# EAGLE design wheel (EAGLE 6.3)
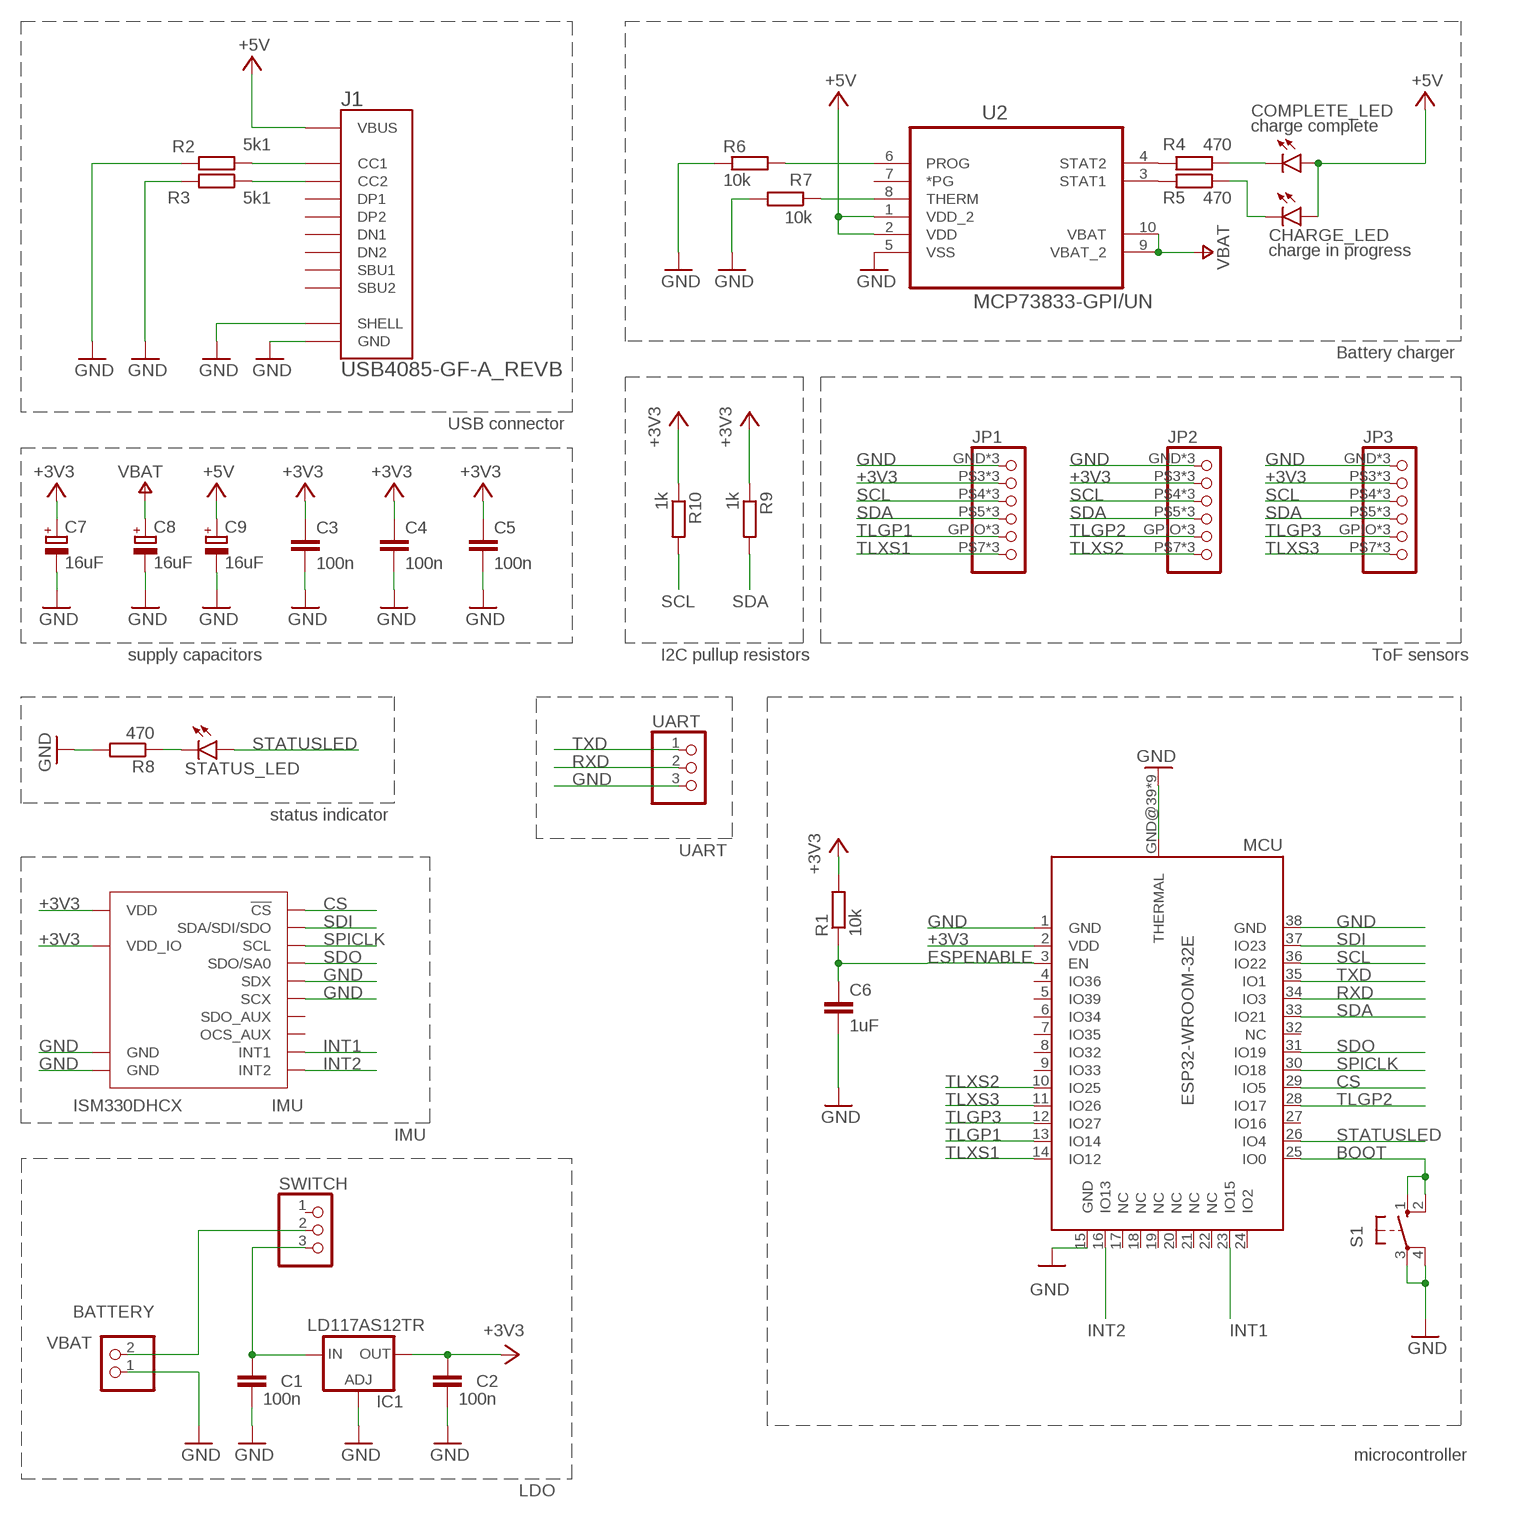
[diagram p0: schematic, sheet 1]

## Parts
BATTERY  PINHD-1X2  [1X02]
C1  100n  C-EUC1206  [C1206]
C2  100n  C-EUC1206  [C1206]
C3  100n  C-EUC1206  [C1206]
C4  100n  C-EUC1206  [C1206]
C5  100n  C-EUC1206  [C1206]
C6  1uF  C-EUC1206  [C1206]
C7  16uF  CPOL-EUE2.5-7  [E2,5-7]
C8  16uF  CPOL-EUE2.5-7  [E2,5-7]
C9  16uF  CPOL-EUE2.5-7  [E2,5-7]
CHARGE_LED  charge in progress  LEDCHIPLED_1206  [CHIPLED_1206]
COMPLETE_LED  charge complete  LEDCHIPLED_1206  [CHIPLED_1206]
IC1  LD117AS12TR  [SOT223]
IMU  ISM330DHCX  [LGA-14L]
J1  USB4085-GF-A_REVB  [GCT_USB4085-GF-A_REVB]
JP1  PINHD-1X6  [1X06]
JP2  PINHD-1X6  [1X06]
JP3  PINHD-1X6  [1X06]
MCU  ESP32-WROOM-32E  [ESP32-WROOM-32E]
R1  10k  R-EU_R1206  [R1206]
R2  5k1  R-EU_R1206  [R1206]
R3  5k1  R-EU_R1206  [R1206]
R4  470  R-EU_R1206  [R1206]
R5  470  R-EU_R1206  [R1206]
R6  10k  R-EU_R1206  [R1206]
R7  10k  R-EU_R1206  [R1206]
R8  470  R-EU_R1206  [R1206]
R9  1k  R-EU_R1206  [R1206]
R10  1k  R-EU_R1206  [R1206]
S1  10-XX  [B3F-10XX]
STATUS_LED  status  LEDCHIPLED_1206  [CHIPLED_1206]
SWITCH  PINHD-1X3  [1X03]
U2  MCP73833-GPI/UN  [SOP50P490X110-10N]
UART  PINHD-1X3  [1X03]

## Nets
+3V3: C2.1 C3.1 C4.1 C5.1 C7.+ IC1.4(OUT) IMU.P5(VDD_IO) IMU.P8(VDD) JP1.P$3 JP1.P$8 JP1.VCC JP2.P$3 JP2.P$8 JP2.VCC JP3.P$3 JP3.P$8 JP3.VCC MCU.2(VDD) R1.2 R9.1 R10.1
+5V: C9.+ CHARGE_LED.A COMPLETE_LED.A J1.A4(VBUS) J1.A9(VBUS) J1.B4(VBUS) J1.B9(VBUS) U2.1(VDD_2) U2.2(VDD)
BOOT: MCU.25(IO0) S1.1(S) S1.2(S1)
CS: IMU.P12(!CS!) MCU.29(IO5)
ESPENABLE: C6.1 MCU.3(EN) R1.1
GND: BATTERY.1 C1.2 C2.2 C3.2 C4.2 C5.2 C6.2 C7.- C8.- C9.- IC1.1(ADJ) IMU.P2(SDX) IMU.P3(SCX) IMU.P6(GND) IMU.P7(GND) J1.A1(GND) J1.A12(GND) J1.B1(GND) J1.B12(GND) J1.S1(SHELL) J1.S2(SHELL) J1.S3(SHELL) J1.S4(SHELL) JP1.GND JP1.P$1 JP1.P$2 JP2.GND JP2.P$1 JP2.P$2 JP3.GND JP3.P$1 JP3.P$2 MCU.1(GND) MCU.15(GND) MCU.38(GND) MCU.GND@39(THERMAL) MCU.GND@40(THERMAL) MCU.GND@41(THERMAL) MCU.GND@42(THERMAL) MCU.GND@43(THERMAL) MCU.GND@44(THERMAL) MCU.GND@45(THERMAL) MCU.GND@46(THERMAL) MCU.GND@47(THERMAL) R2.2 R3.2 R6.2 R7.2 R8.2 S1.3(P) S1.4(P1) U2.5(VSS) UART.3
INT1: IMU.P4(INT1) MCU.23(IO15)
INT2: IMU.P9(INT2) MCU.16(IO13)
N$1: R4.2 U2.4(STAT2)
N$2: C1.1 IC1.3(IN) SWITCH.3
N$3: J1.A5(CC1) R2.1
N$4: J1.B5(CC2) R3.1
N$8: R5.2 U2.3(STAT1)
N$9: R6.1 U2.6(PROG)
N$18: COMPLETE_LED.C R4.1
N$19: CHARGE_LED.C R5.1
N$20: R7.1 U2.8(THERM)
N$21: R8.1 STATUS_LED.C
RXD: MCU.34(IO3) UART.2
SCL: JP1.P$4 JP1.P$9 JP1.SCL JP2.P$4 JP2.P$9 JP2.SCL JP3.P$4 JP3.P$9 JP3.SCL MCU.36(IO22) R10.2
SDA: JP1.P$5 JP1.P$10 JP1.SDA JP2.P$5 JP2.P$10 JP2.SDA JP3.P$5 JP3.P$10 JP3.SDA MCU.33(IO21) R9.2
SDI: IMU.P14(SDA/SDI/SDO) MCU.37(IO23)
SDO: IMU.P1(SDO/SA0) MCU.31(IO19)
SPICLK: IMU.P13(SCL) MCU.30(IO18)
STATUSLED: MCU.26(IO4) STATUS_LED.A
TLGP1: JP1.GPIO JP1.P$6 JP1.P$11 MCU.13(IO14)
TLGP2: JP2.GPIO JP2.P$6 JP2.P$11 MCU.28(IO17)
TLGP3: JP3.GPIO JP3.P$6 JP3.P$11 MCU.12(IO27)
TLXS1: JP1.P$7 JP1.P$12 JP1.XSHUT MCU.14(IO12)
TLXS2: JP2.P$7 JP2.P$12 JP2.XSHUT MCU.10(IO25)
TLXS3: JP3.P$7 JP3.P$12 JP3.XSHUT MCU.11(IO26)
TXD: MCU.35(IO1) UART.1
VBAT: BATTERY.2 C8.+ SWITCH.2 U2.9(VBAT_2) U2.10(VBAT)
Unconnected: IMU.P10(OCS_AUX) IMU.P11(SDO_AUX) J1.A6(DP1) J1.A7(DN1) J1.A8(SBU1) J1.B6(DP2) J1.B7(DN2) J1.B8(SBU2) MCU.4(IO36) MCU.5(IO39) MCU.6(IO34) MCU.7(IO35) MCU.8(IO32) MCU.9(IO33) MCU.17(NC) MCU.18(NC) MCU.19(NC) MCU.20(NC) MCU.21(NC) MCU.22(NC) MCU.24(IO2) MCU.27(IO16) MCU.32(NC) SWITCH.1 U2.7(*PG)

## Notes on the sheet
- Battery charger
- USB connector
- supply capacitors | I2C pullup resistors | ToF sensors
- status indicator
- UART
- IMU
- microcontroller
- LDO

## Library data of the parts
BATTERY = pinhead:PINHD-1X2: PIN HEADER
C1-C6 = rcl:C-EU: CAPACITOR, European symbol; SPICEPREFIX: C
C7-C9 = rcl:CPOL-EU: POLARIZED CAPACITOR, European symbol; SPICEPREFIX: C
CHARGE_LED COMPLETE_LED STATUS_LED = led:LED: LED OSRAM: - CHIPLED LG R971, LG N971, LY N971, LG Q971, LY Q971, LO R971, LY R971 LH N974, LH R974 LS Q976, LO Q976, LY Q976 LO Q996 - Hyper CHIPLED LW Q18S LB Q993, LB Q99A, LB R99A - SideLED LS A670, LO A670, LY A670, LG A670, LP A670 LB A673, LV A673, LT A673, LW A673 LH A674 LY A675 LS A676, LA A676, LO A676, LY A676, LW A676 LS A679, LY A679, LG A679 - Hyper Micro SIDELED® LS Y876, LA Y876, LO Y876, LY Y876 LT Y87S - SmartLED LW L88C, LW L88S LB L89C, LB L89S, LG L890 LS L89K, LO L89K, LY L89K LS L896, LA L896, LO L896, LY L896 - TOPLED LS T670, LO T670, LY T670, LG T670, LP T670 LSG T670, LSP T670, LSY T670, LOP T670, LYG T670 LG T671, LOG T671, LSG T671 LB T673, LV T673, LT T673, LW T673 LH T674 LS T676, LA T676, LO T676, LY T676, LB T676, LH T676, LSB T676, LW T676 LB T67C, LV T67C, LT T67C, LS T67K, LO T67K, LY T67K, LW E67C LS E67B, LA E67B, LO E67B, LY E67B, LB E67C, LV E67C, LT E67C LW T67C LS T679, LY T679, LG T679 LS T770, LO T770, LY T770, LG T770, LP T770 LB T773, LV T773, LT T773, LW T773 LH T774 LS E675, LA E675, LY E675, LS T675 LS T776, LA T776, LO T776, LY T776, LB T776 LHGB T686 LT T68C, LB T68C - Hyper Mini TOPLED® LB M676 - Mini TOPLED Santana® LG M470 LS M47K, LO M47K, LY M47K Source: http://www.osram.convergy.de LUXEON: - LUMILED® LXK2-PW12-R00, LXK2-PW12-S00, LXK2-PW14-U00, LXK2-PW14-V00 LXK2-PM12-R00, LXK2-PM12-S00, LXK2-PM14-U00 LXK2-PE12-Q00, LXK2-PE12-R00, LXK2-PE12-S00, LXK2-PE14-T00, LXK2-PE14-U00 LXK2-PB12-K00, LXK2-PB12-L00, LXK2-PB12-M00, LXK2-PB14-N00, LXK2-PB14-P00, LXK2-PB14-Q00 LXK2-PR12-L00, LXK2-PR12-M00, LXK2-PR14-Q00, LXK2-PR14-R00 LXK2-PD12-Q00, LXK2-PD12-R00, LXK2-PD12-S00 LXK2-PH12-R00, LXK2-PH12-S00 LXK2-PL12-P00, LXK2-PL12-Q00, LXK2-PL12-R00 Source: www.luxeon.com KINGBRIGHT: KA-3528ASYC Source: www.kingbright.com
IC1 = v-reg:LD117A?*: Low drop fixed and adjustable positive voltage regulators 1 A Source: http://www.st.com/stonline/products/literature/ds/7194/ld1117axx.pdf
IMU = SparkFun-Sensors:ISM330DHCX: ISM330DHCX 6DoF The ISM330DHCX is a system-in-package featuring a high-performance 3D digital accelerometer and 3D digital gyroscope tailored for Industry 4.0 applications.; PROD_ID: IC-16693
J1 = USB4085-GF-A_REVB:USB4085-GF-A_REVB: Check availability <https://pricing.snapeda.com/parts/USB4085-GF-A/Global%20Connector%20Technology/view-part?ref=eda>; AVAILABILITY: In Stock; CHECK_PRICES: https://www.snapeda.com/parts/USB4085-GF-A/Global+Connector+Technology/view-part/?ref=eda; DESCRIPTION: USB-C (USB TYPE-C) USB 2.0 Receptacle Connector 24 (16+8 Dummy) Position Through Hole, Right Angle, low cost, 3.46mm profile, 16 pin, horizontal, Top mount; MF: Global Connector Technology; MP: USB4085-GF-A; PACKAGE: None; PRICE: None; PURCHASE-URL: https://www.snapeda.com/api/url_track_click_mouser/?unipart_id=2780390&manufacturer=Global Connector Technology&part_name=USB4085-GF-A&search_term=usb connector lumberg; SNAPEDA_LINK: https://www.snapeda.com/parts/USB4085-GF-A/Global+Connector+Technology/view-part/?ref=snap
JP1-JP3 = pinhead2:PINHD-1X6: PIN HEADER
MCU = ESP32-WROOM-32E:ESP32-WROOM-32E: Check availability <https://pricing.snapeda.com/parts/ESP32-WROOM-32E/Espressif%20Systems/view-part?ref=eda>; AVAILABILITY: In Stock; CHECK_PRICES: https://www.snapeda.com/parts/ESP32-WROOM-32E/Espressif+Systems/view-part/?ref=eda; DESCRIPTION: RX TXRX MOD WIFI TRACE ANT SMD; MF: Espressif Systems; MP: ESP32-WROOM-32E; PACKAGE: SMD-44 Espressif Systems; PRICE: None; SNAPEDA_LINK: https://www.snapeda.com/parts/ESP32-WROOM-32E/Espressif+Systems/view-part/?ref=snap
R1-R10 = rcl:R-EU_: RESISTOR, European symbol; SPICEPREFIX: R
S1 = switch-omron:10-XX: OMRON SWITCH; MPN: B3F-1000; OC_FARNELL: 176432; OC_NEWARK: 36M3542
SWITCH UART = pinhead:PINHD-1X3: PIN HEADER
U2 = MCP73833-GPI_UN:MCP73833-GPI/UN: LI-ION/LI-POLY CONTROLLERS Check availability <https://pricing.snapeda.com/parts/MCP73833-GPI/UN/Microchip/view-part?ref=eda>; AVAILABILITY: In Stock; CHECK_PRICES: https://www.snapeda.com/parts/MCP73833-GPI/UN/Microchip/view-part/?ref=eda; DESCRIPTION: Microchip MCP73833-GPI/UN, Charge Management Controller, 1000mA, 10-Pin MSOP | Microchip Technology Inc. MCP73833-GPI/UN; MF: Microchip; MP: MCP73833-GPI/UN; PACKAGE: MSOP-10 Microchip; PRICE: None; SNAPEDA_LINK: https://www.snapeda.com/parts/MCP73833-GPI/UN/Microchip/view-part/?ref=snap

## Board
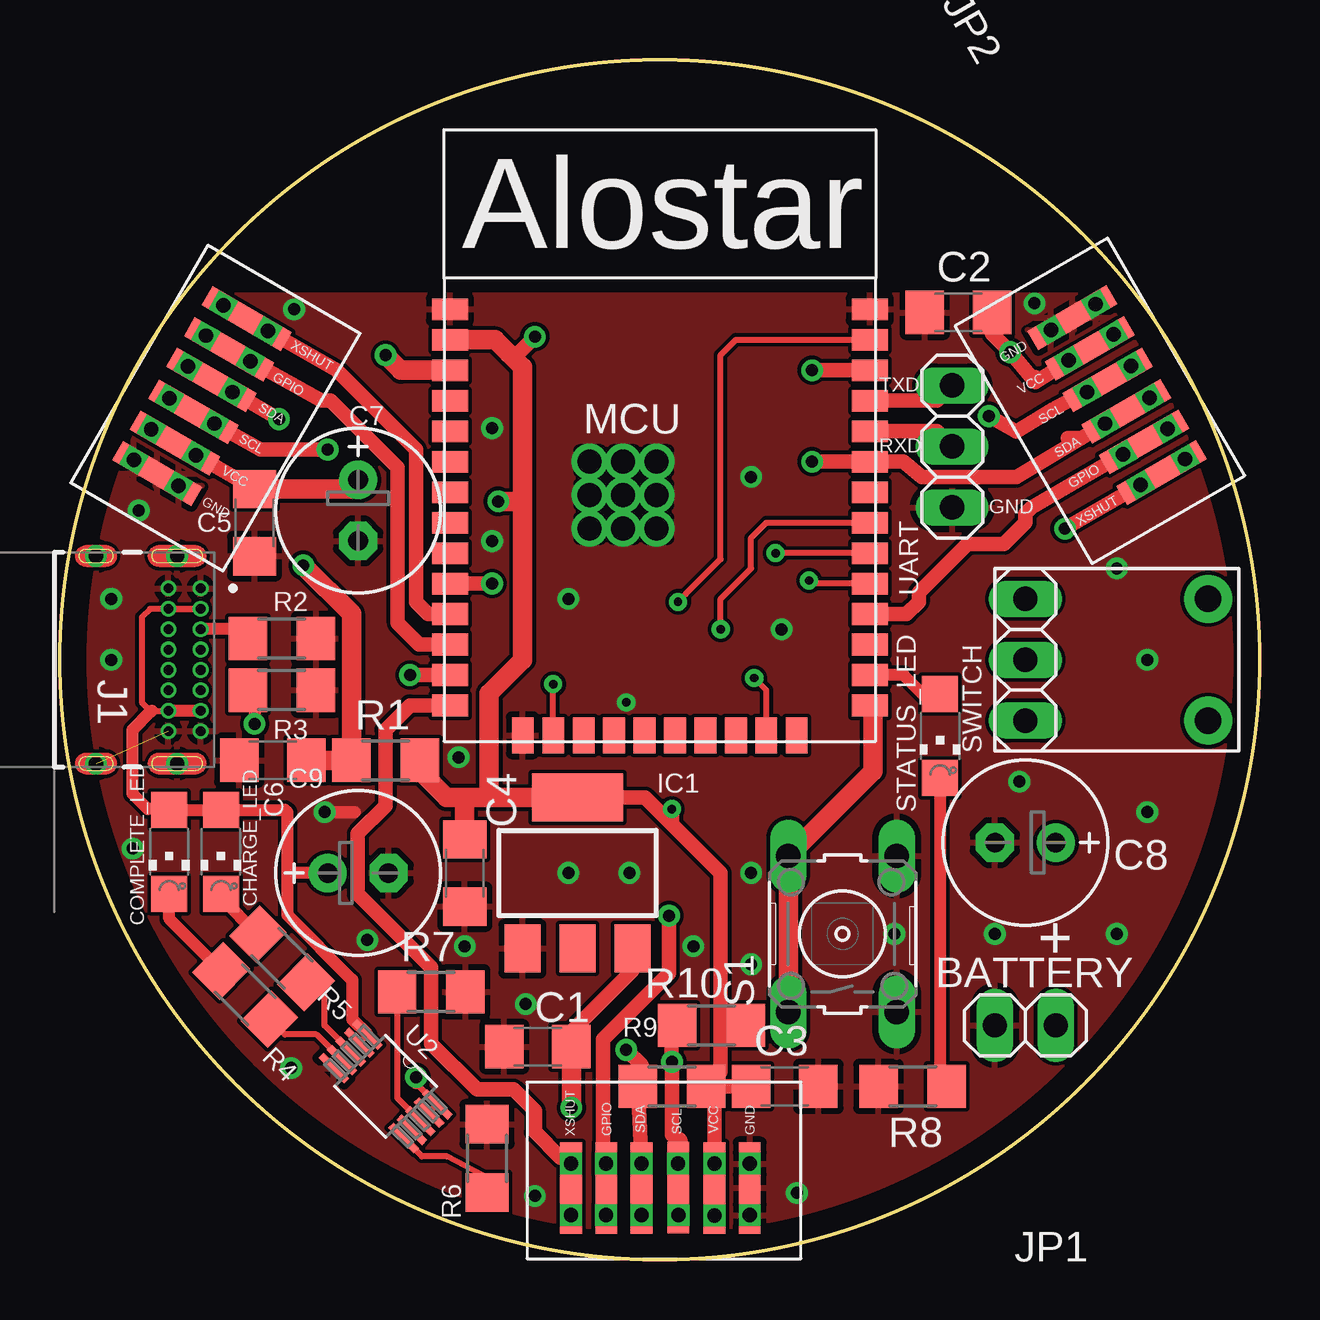
[diagram p1: board, top side]
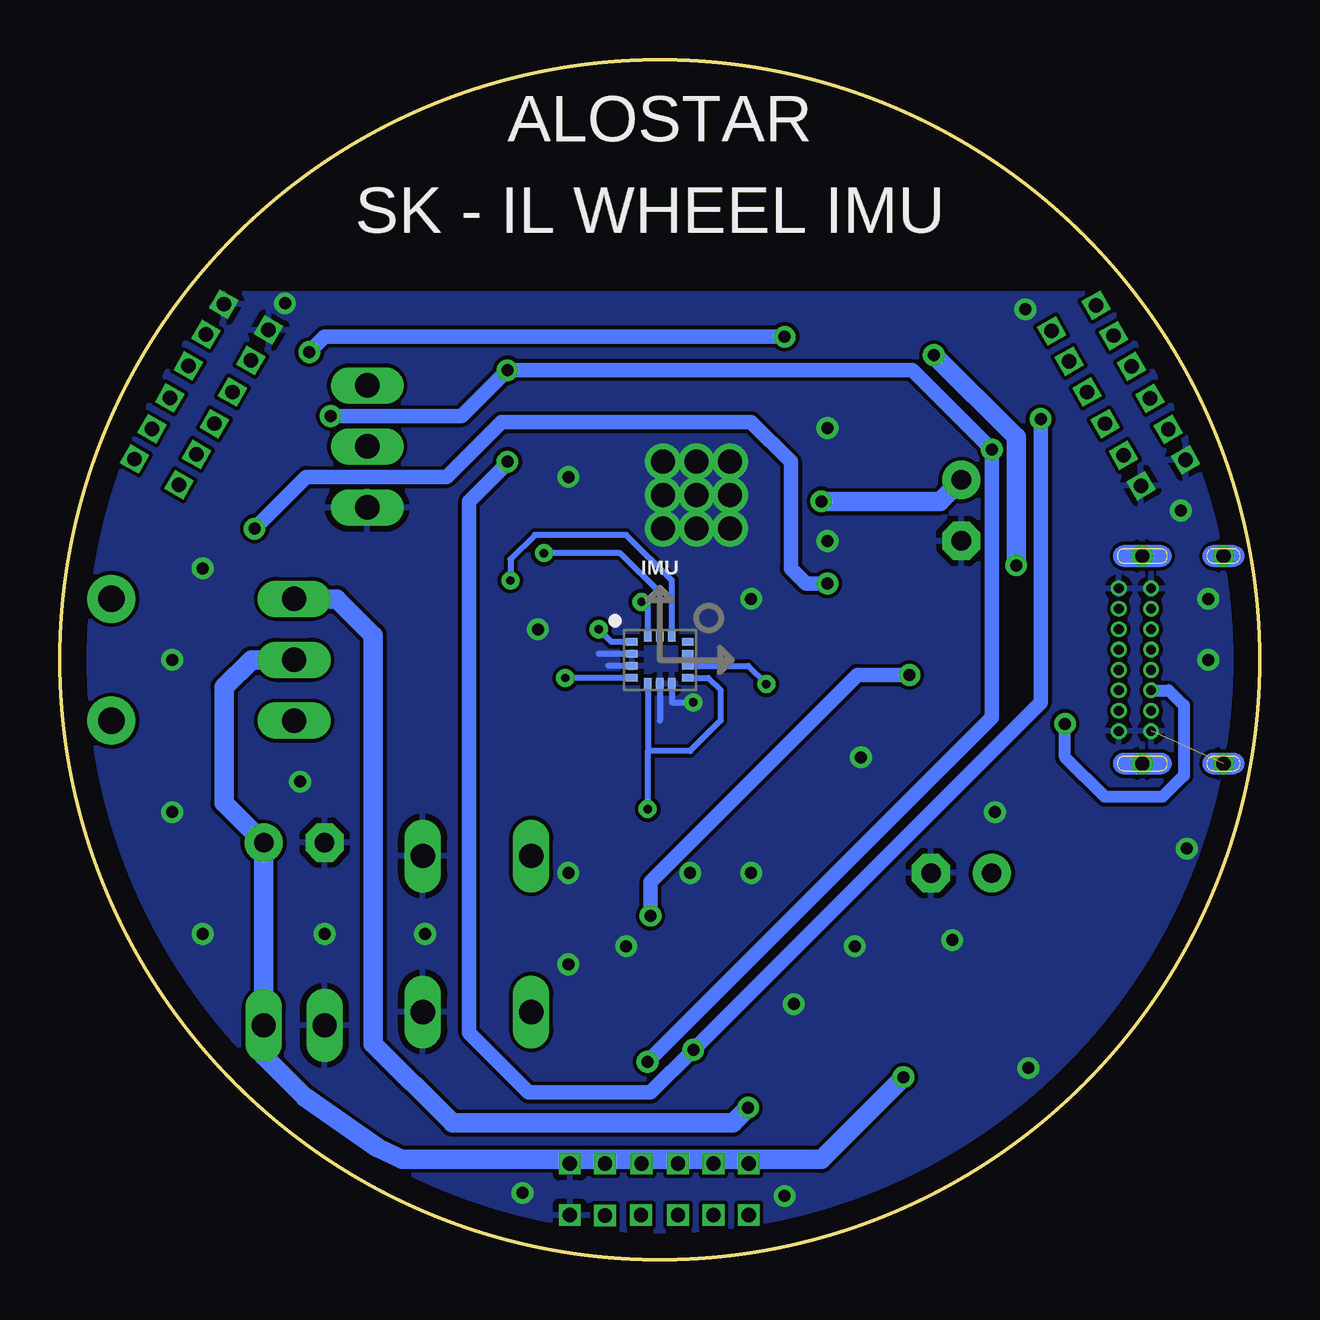
[diagram p2: board, bottom side, seen from below]

Size 50 x 50 mm. Coordinates in mm from the lower left corner, seen from the top.
Outline: circle at 25,25 radius 25
Copper layers (1*16): Top 0.035mm / dielectric 1.5mm / Bottom 0.035mm
Design rules "default *": minimum track width 6mil, minimum drill 0.35mm, track to track 6mil, track to pad 6mil, pad to pad 6mil, via to via 6mil, smd to smd 6mil, copper to edge 40mil, drill to drill 6mil, minimum pad ring 5mil, minimum via ring 8mil, stop-mask expansion 4mil, vias tented up to drill 0mil, thermal gap 10mil

### Footprints (pad centres in the part's own frame; a part is rotated, then mirrored left to right if it is on the bottom)
1X02 = drill 1.016 long: 1 -1.27,0; 2 1.27,0
C1206 = smd 1.6 x 1.8: 1 -1.4,0; 2 1.4,0
E2,5-7 = drill 0.813 pad 1.6: + -1.27,0 | drill 0.813 pad 1.6 octagon: - 1.27,0
CHIPLED_1206 = smd 1.5 x 1.5: A 0,-1.75; C 0,1.75
SOT223 = smd 1.5 x 2: 1 -2.3,-3.15; 2 0,-3.15; 3 2.3,-3.15 | smd 3.8 x 2: 4 0,3.15
LGA-14L = smd 0.48 x 0.3: P1 -1.163,0.75; P2 -1.163,0.25; P3 -1.163,-0.25; P4 -1.163,-0.75; P8 1.163,-0.75; P9 1.163,-0.25; P10 1.163,0.25; P11 1.163,0.75 | smd 0.3 x 0.48: P5 -0.5,-1; P6 0,-1; P7 0.5,-1; P12 0.5,1; P13 0,1; P14 -0.5,1
GCT_USB4085-GF-A_REVB = drill 0.4 pad 0.65: A1 -2.975,4.36; A4 -2.125,4.36; A5 -1.275,4.36; A6 -0.425,4.36; A7 0.425,4.36; A8 1.275,4.36; A9 2.125,4.36; A12 2.975,4.36; B1 2.975,3.01; B4 2.125,3.01; B5 1.275,3.01; B6 0.425,3.01; B7 -0.425,3.01; B8 -1.275,3.01; B9 -2.125,3.01; B12 -2.975,3.01 | drill 0.6 pad 0.9: S1 -4.325,0; S2 4.325,0; S3 -4.325,3.38; S4 4.325,3.38
1X06 = smd 0.914 x 3.81: GND -3.75,0.02; GPIO 2.23,0.02; SCL -0.77,0; SDA 0.76,0.02; VCC -2.28,0.02; XSHUT 3.7,0.02 | drill 0.6 pad 0.813 square: P$1 -3.75,1.15; P$2 -3.75,-1; P$3 -2.28,-1; P$4 -0.76,-1; P$5 0.76,-1; P$6 2.24,-1; P$7 3.7,-1; P$8 -2.28,1.16; P$9 -0.78,1.14; P$10 0.76,1.14; P$11 2.24,1.14; P$12 3.7,1.14
ESP32-WROOM-32E = smd 1.5 x 0.9: 1 -8.75,8.255; 2 -8.75,6.985; 3 -8.75,5.715; 4 -8.75,4.445; 5 -8.75,3.175; 6 -8.75,1.905; 7 -8.75,0.635; 8 -8.75,-0.635; 9 -8.75,-1.905; 10 -8.75,-3.175; 11 -8.75,-4.445; 12 -8.75,-5.715; 13 -8.75,-6.985; 14 -8.75,-8.255; 25 8.75,-8.255; 26 8.75,-6.985; 27 8.75,-5.715; 28 8.75,-4.445; 29 8.75,-3.175; 30 8.75,-1.905; 31 8.75,-0.635; 32 8.75,0.635; 33 8.75,1.905; 34 8.75,3.175; 35 8.75,4.445; 36 8.75,5.715; 37 8.75,6.985; 38 8.75,8.255 | smd 0.9 x 1.5: 15 -5.715,-9.505; 16 -4.445,-9.505; 17 -3.175,-9.505; 18 -1.905,-9.505; 19 -0.635,-9.505; 20 0.635,-9.505; 21 1.905,-9.505; 22 3.175,-9.505; 23 4.445,-9.505; 24 5.715,-9.505 | smd 0.9 x 0.9: GND@39 -2.9,1.935; GND@40 -1.5,1.935; GND@41 -0.1,1.935; GND@42 -2.9,0.535; GND@43 -1.5,0.535; GND@44 -0.1,0.535; GND@45 -2.9,-0.865; GND@46 -1.5,-0.865; GND@47 -0.1,-0.865
R1206 = smd 1.6 x 1.803: 1 -1.422,0; 2 1.422,0
B3F-10XX = drill 1.016 long: 1 -3.251,2.261; 2 3.251,2.261; 3 -3.251,-2.261; 4 3.251,-2.261
1X03 = drill 1.016 long: 1 -2.54,0; 2 0,0; 3 2.54,0
SOP50P490X110-10N = smd 1.499 x 0.305: 1 -2.057,0.991; 2 -2.057,0.508; 3 -2.057,0; 4 -2.057,-0.508; 5 -2.057,-0.991; 6 2.057,-0.991; 7 2.057,-0.508; 8 2.057,0; 9 2.057,0.508; 10 2.057,0.991

### Placement (x,y rotation side)
BATTERY  40.24,9.76 0 top
C1  19.92,8.87 180 top
C2  37.45,39.48 180 top
C3  30.21,7.22 0 top
C4  16.87,16.11 270 top
C5  8.11,30.71 270 top
C6  8.87,20.81 180 top
C7  12.43,31.22 270 top
C8  40.24,17.38 180 top
C9  12.43,16.11 0 top
CHARGE_LED  6.71,17 180 top
COMPLETE_LED  4.55,17 180 top
IC1  21.57,16.11 0 top
IMU  25,25 0 bottom
J1  1.5,25 270 top
JP1  25,3 180 top
JP2  44.05,36 300 top
JP3  5.95,36 60 top
MCU  25,31.35 0 top
R1  13.57,20.81 0 top
R2  9.25,25.89 0 top
R3  9.25,23.73 0 top
R4  7.73,11.03 315 top
R5  9.25,12.55 315 top
R6  17.8,4.22 90 top
R7  15.47,11.16 0 top
R8  35.54,7.22 180 top
R9  25.51,7.22 180 top
R10  27.16,9.76 180 top
S1  32.62,13.57 90 top
STATUS_LED  36.68,21.82 180 top
SWITCH  40.24,25 90 top
U2  13.57,7.22 315 top
UART  37.19,33.89 270 top

### Tracks (layer width: path | path; a pad name or v marks a point on that pad's centre or on a via)
+3V3  (via drill 0.35, 0.5)
  Top 0.61: IC1.4 24.39,19.26 25.51,18.14 | 25.51,18.14 27.54,16.11 27.54,9.76 | v25.51,18.78 25.51,18.14 | v19.79,38.46 19.09,37.76 18.71,37.76 | R10.1 27.54,9.76 | C2.1 38.85,38.59 v39.61,37.83 40.65,36.58 | R9.1 27.54,7.83 27.54,9.76 | R9.1 27.28,6.87 JP1.P$3 JP1.VCC JP1.P$8 | C3.1 R9.1 | 40.65,36.58 JP2.VCC | 40.65,36.78 40.65,36.58 | JP3.P$8 JP3.VCC | JP3.VCC JP3.P$3 | JP3.P$3 5.57,33.51 JP3.VCC | JP3.P$3 C5.1 | JP2.VCC JP2.P$8 | JP2.VCC JP2.P$3
  Top 0.813: 19.29,31.35 19.29,37.19 18.71,37.76 18.14,38.34 MCU.2 | 19.29,31.35 19.29,25 17.89,23.6 17.89,19.26 | 17.89,19.26 IC1.4 | v18.27,31.6 19.03,31.6 19.29,31.35 | C5.1 12.3,32.12 12.43,32.24 C7.+ | 15.37,20.43 R1.2 14.99,20.38 16.11,19.26 16.87,19.26 | C4.1 16.87,19.26 | 17.89,19.26 16.87,19.26
  Bottom 0.254: 25.5,21.19 23.73,21.19 22.46,22.46 22.46,23.73 22.98,24.25 IMU.P8 | v25.51,18.78 v25.5,18.79 25.5,21.19 | IMU.P5 25.5,21.19
  Bottom 0.61: v19.79,38.46 38.97,38.46 v39.61,37.83
  Bottom 0.813: C7.+ 13.32,31.6 v18.27,31.6
+5V
  Top 0.254: J1.B9 J1.A4 3.76,27.12 3.41,26.78 3.41,23.22 3.76,22.88 | 3.76,22.88 J1.B4 | U2.1 U2.2 | 3.76,22.88 3.79,22.84
  Top 0.508: J1.A9 J1.B4 | U2.1 12.18,10.01 12.18,11.66 9.48,14.36 9.48,16.36 | 9.48,16.36 9.48,18.65 9.38,18.75 CHARGE_LED.A COMPLETE_LED.A 4.52,18.78 3.66,18.78 3.03,19.41 3.03,22.08 3.79,22.84 3.82,22.88 | C9.+ 9.73,16.11 arc-90 9.48,16.36
BOOT
  Top 0.61: MCU.25 33.89,22.95
  Top 0.813: 33.89,22.95 33.89,20.35 S1.2 S1.1
CS  (via drill 0.35)
  Top 0.254: MCU.29 31.35,28.18 v31.22,28.3
  Bottom 0.254: IMU.P12 24.5,28.31 26.4,30.21 30.21,30.21 31.22,29.19 v31.22,28.3
ESPENABLE  (via drill 0.5)
  Top 0.813: MCU.3 14.21,37.06 v13.57,37.7 | v10.14,28.94 12.15,26.93 R1.1 C6.1
  Bottom 0.813: v13.57,37.7 10.14,34.27 v10.14,28.94
GND  (via drill 0.35, 0.5, 1)  (1 unrouted)
  Top 0.508: v11.03,18.65 12.3,18.65
  Top 0.61: R6.2 17.89,5.57
  Bottom 0.254: IMU.P2 27.54,25.25 | IMU.P3 27.16,24.75 | IMU.P6 25,22.46 | IMU.P7 24.5,23.22 v23.6,23.22
  other vias: 22.08,33.26 22.08,31.86 22.08,30.46 23.48,30.46 23.48,31.86 23.48,33.26 24.87,33.26 24.87,31.86 24.87,30.46 21.19,16.11 2.14,27.54 23.73,16.11 9.76,39.61 16.62,20.94 39.99,19.92 45.32,18.65 45.32,25 44.05,28.81 44.05,13.57 30.71,2.77 9.63,7.98 16.87,13.06 3.28,31.22 2.14,25 21.19,27.54 28.81,32.62 28.81,12.3 28.81,16.11 34.78,13.57 12.81,13.32 30.08,26.27 19.41,10.65 26.4,13.06 38.97,13.57 40.62,39.86 3.03,17.13 18.02,34.65 18.02,29.95 19.79,2.65
  pour Top: -0.4,40.24 50.4,40.24 50.4,-0.4 -0.4,-0.4
  pour Bottom: -1.67,40.24 50.4,40.24 50.4,-0.4 -1.67,-0.4
INT1  (via drill 0.35)
  Top 0.254: MCU.23 29.45,23.73 v28.94,24.24
  Bottom 0.254: IMU.P4 v28.94,24.25 v28.94,24.24
INT2  (via drill 0.35)
  Top 0.254: MCU.16 v20.55,23.98
  Bottom 0.254: IMU.P9 21.32,24.75 v20.55,23.98
N$1
  Top 0.254: U2.4 10.69,9.38 9.38,9.38 R4.2
N$2  (via drill 0.5)
  Top 0.61: IC1.3 23.87,12.06 21.19,9.38 21.19,9 C1.1
  Top 0.813: C1.1 v21.32,6.33
  Bottom 0.813: SWITCH.3 38.46,27.54 36.94,26.02 36.94,9 33.64,5.7 21.95,5.7 v21.32,6.33
N$3
  Top 0.508: R2.1 7.44,26.27 J1.A5
N$4  (via drill 0.5)
  Top 0.508: R3.1 8.11,23.45 v8.11,22.33
  Bottom 0.508: J1.B5 3.79,23.73 3.16,23.09 3.16,20.17 4.05,19.29 6.46,19.29 8.11,20.94 v8.11,22.33
N$5  (via drill 1.1 pad 2)
  other vias: 47.86,27.54
N$6  (via drill 1.1 pad 2)
  other vias: 47.86,22.46
N$8
  Top 0.254: U2.3 11.03,9.76 11.03,11.03 10.51,11.55 R5.2
N$9
  Top 0.254: 17.99,3.32 16.13,4.3 15.09,4.3 U2.6
  Top 0.406: R6.1 17.8,3.12 17.99,3.32
N$18
  Top 0.508: R4.1 4.55,14.21 COMPLETE_LED.C
N$19
  Top 0.508: R5.1 6.71,15.09 CHARGE_LED.C
N$20
  Top 0.254: R7.1 14.05,6.74 U2.8
N$21
  Top 0.508: STATUS_LED.C 36.68,7.5 R8.1
RXD
  Top 0.61: MCU.34 36.56,34.52 UART.2
SCL  (via drill 0.5)
  Top 0.254: JP3.P$9 JP3.P$4 JP3.SCL
  Top 0.61: v11.16,33.76 8.36,33.76 JP3.P$4 | JP2.SCL 41.37,35.42 39.87,34.5 v38.72,35.16 | MCU.36 v31.35,37.06 | 25.48,9.51 25.48,8.26 v25.51,8.24 25.52,8.23 25.52,5.45 25.51,5.44 25.51,5.19 25.77,4.93 | JP2.SCL JP2.P$9 | JP2.SCL JP2.P$4 | JP1.P$4 JP1.SCL JP1.P$9
  Top 0.813: R10.2 25.48,9.51 | 25.77,4.93 JP1.P$4
  Bottom 0.61: v25.51,8.24 11.16,22.59 v11.16,33.76 14.46,37.06 v31.35,37.06 33.26,35.16 v38.72,35.16
SDA  (via drill 0.5)
  Top 0.61: 43.83,34.98 JP2.SDA JP2.P$10 | 43.83,34.98 42.57,34.24 | 42.57,34.24 39.86,32.62 35.92,32.62 35.16,33.26 MCU.33 v31.35,33.26 | 42.02,34.24 42.57,34.24 | v23.6,8.74 24.24,8.11 24.24,7.09 R9.2 JP1.P$5 JP1.SDA JP1.P$10 | v9.12,35.03 JP3.P$5 JP3.SDA JP3.P$10 | JP2.P$5 43.83,34.98
  Bottom 0.61: v31.35,33.26 31.35,33.19 32.95,31.59 32.95,9.45 30.46,6.97 25.38,6.97 v23.6,8.74 9.12,23.22 v9.12,35.03
SDI  (via drill 0.35)
  Top 0.254: v25.76,27.41 26.08,27.73 27.54,29.19 27.54,37.7 28.18,38.34 MCU.37
  Bottom 0.254: IMU.P14 25.5,27.41 v25.76,27.41
SDO  (via drill 0.35)
  Top 0.254: v27.54,26.27 27.54,27.54 28.81,28.81 28.81,30.08 29.45,30.71 MCU.31
  Bottom 0.254: IMU.P1 27.02,25.75 v27.54,26.27
SPICLK  (via drill 0.35)
  Top 0.254: MCU.30 v29.83,29.45
  Bottom 0.254: IMU.P13 25,27.79 26.65,29.45 v29.83,29.45
STATUSLED
  Top 0.508: STATUS_LED.A 36.32,23.21 35.16,24.36 MCU.26
TLGP1  (via drill 0.5)
  Top 0.61: v25.38,14.33 25.38,11.92 22.64,9.18 22.64,3.11 JP1.GPIO | v14.59,24.36 MCU.13 | JP1.P$6 JP1.GPIO | JP1.P$11 22.84,1.5 22.71,2.01 JP1.GPIO
  Bottom 0.61: v25.38,14.33 25.38,15.75 16.76,24.36 v14.59,24.36
TLGP2
  Top 0.61: JP2.GPIO 40.49,31.35 40.24,31.1 40.24,30.71 39.35,29.83 37.83,29.83 35.8,27.79 35.8,27.41 35.29,26.91 MCU.28 | JP2.P$11 JP2.GPIO | JP2.GPIO JP2.P$6
TLGP3
  Top 0.254: JP3.P$11 JP3.P$6 JP3.GPIO
  Top 0.61: JP3.GPIO 10.9,35.8 11.28,35.8 14.08,33 14.08,26.52 14.97,25.64 MCU.12
TLXS1
  Top 0.61: MCU.14 14.59,23.09 13.57,22.08 13.57,18.91 12.41,17.76 12.41,15.23 15.47,12.17 15.47,9 17.38,7.09 18.9,7.09 19.79,6.2 19.79,5.32 20.86,4.25 21.3,4.25 JP1.P$7 JP1.XSHUT JP1.P$12
TLXS2  (via drill 0.5)
  Top 0.61: JP2.XSHUT v41.89,30.46 | MCU.10 v18.02,28.18 | JP2.P$12 JP2.XSHUT | JP2.XSHUT JP2.P$7
  Bottom 0.61: v41.89,30.46 39.73,32.62 33.89,32.62 31.6,34.91 21.19,34.91 19.54,33.26 19.54,28.81 18.9,28.18 v18.02,28.18
TLXS3
  Top 0.254: JP3.P$12 JP3.XSHUT JP3.P$7
  Top 0.61: JP3.XSHUT 11.54,37.06 14.84,33.76 14.84,27.41 15.35,26.91 MCU.11
TXD
  Top 0.61: MCU.35 36.56,35.8 UART.1
VBAT  (via drill 0.5)
  Top 0.254: U2.9 U2.10 14.84,7.35
  Top 0.508: v14.84,7.6 14.84,7.35
  Bottom 0.813: SWITCH.2 42.02,25 43.16,23.86 43.16,19.03 C8.+ BATTERY.2 41.51,8.49 39.81,6.79 36.75,4.65 35.73,4.17 18.27,4.17 v14.84,7.6

### Text on the board
tPlace: +
tNames: Alostar | TXD | RXD | GND
bNames: ALOSTAR | SK - IL WHEEL IMU
tDocu: TOF3 | TOF2 | GND | TXD | RXD | GND | GND | TOF1 | GND
bDocu: ALOSTAR